# EasyEDA schematic SCH_AGV_genzero_main_board_2024-06-24.json
TITLE: Sheet_1; REV: 1.0; Date: 2024-02-19; Sheet: 1/1; Drawn By: Araf Israk; Company: Your Company
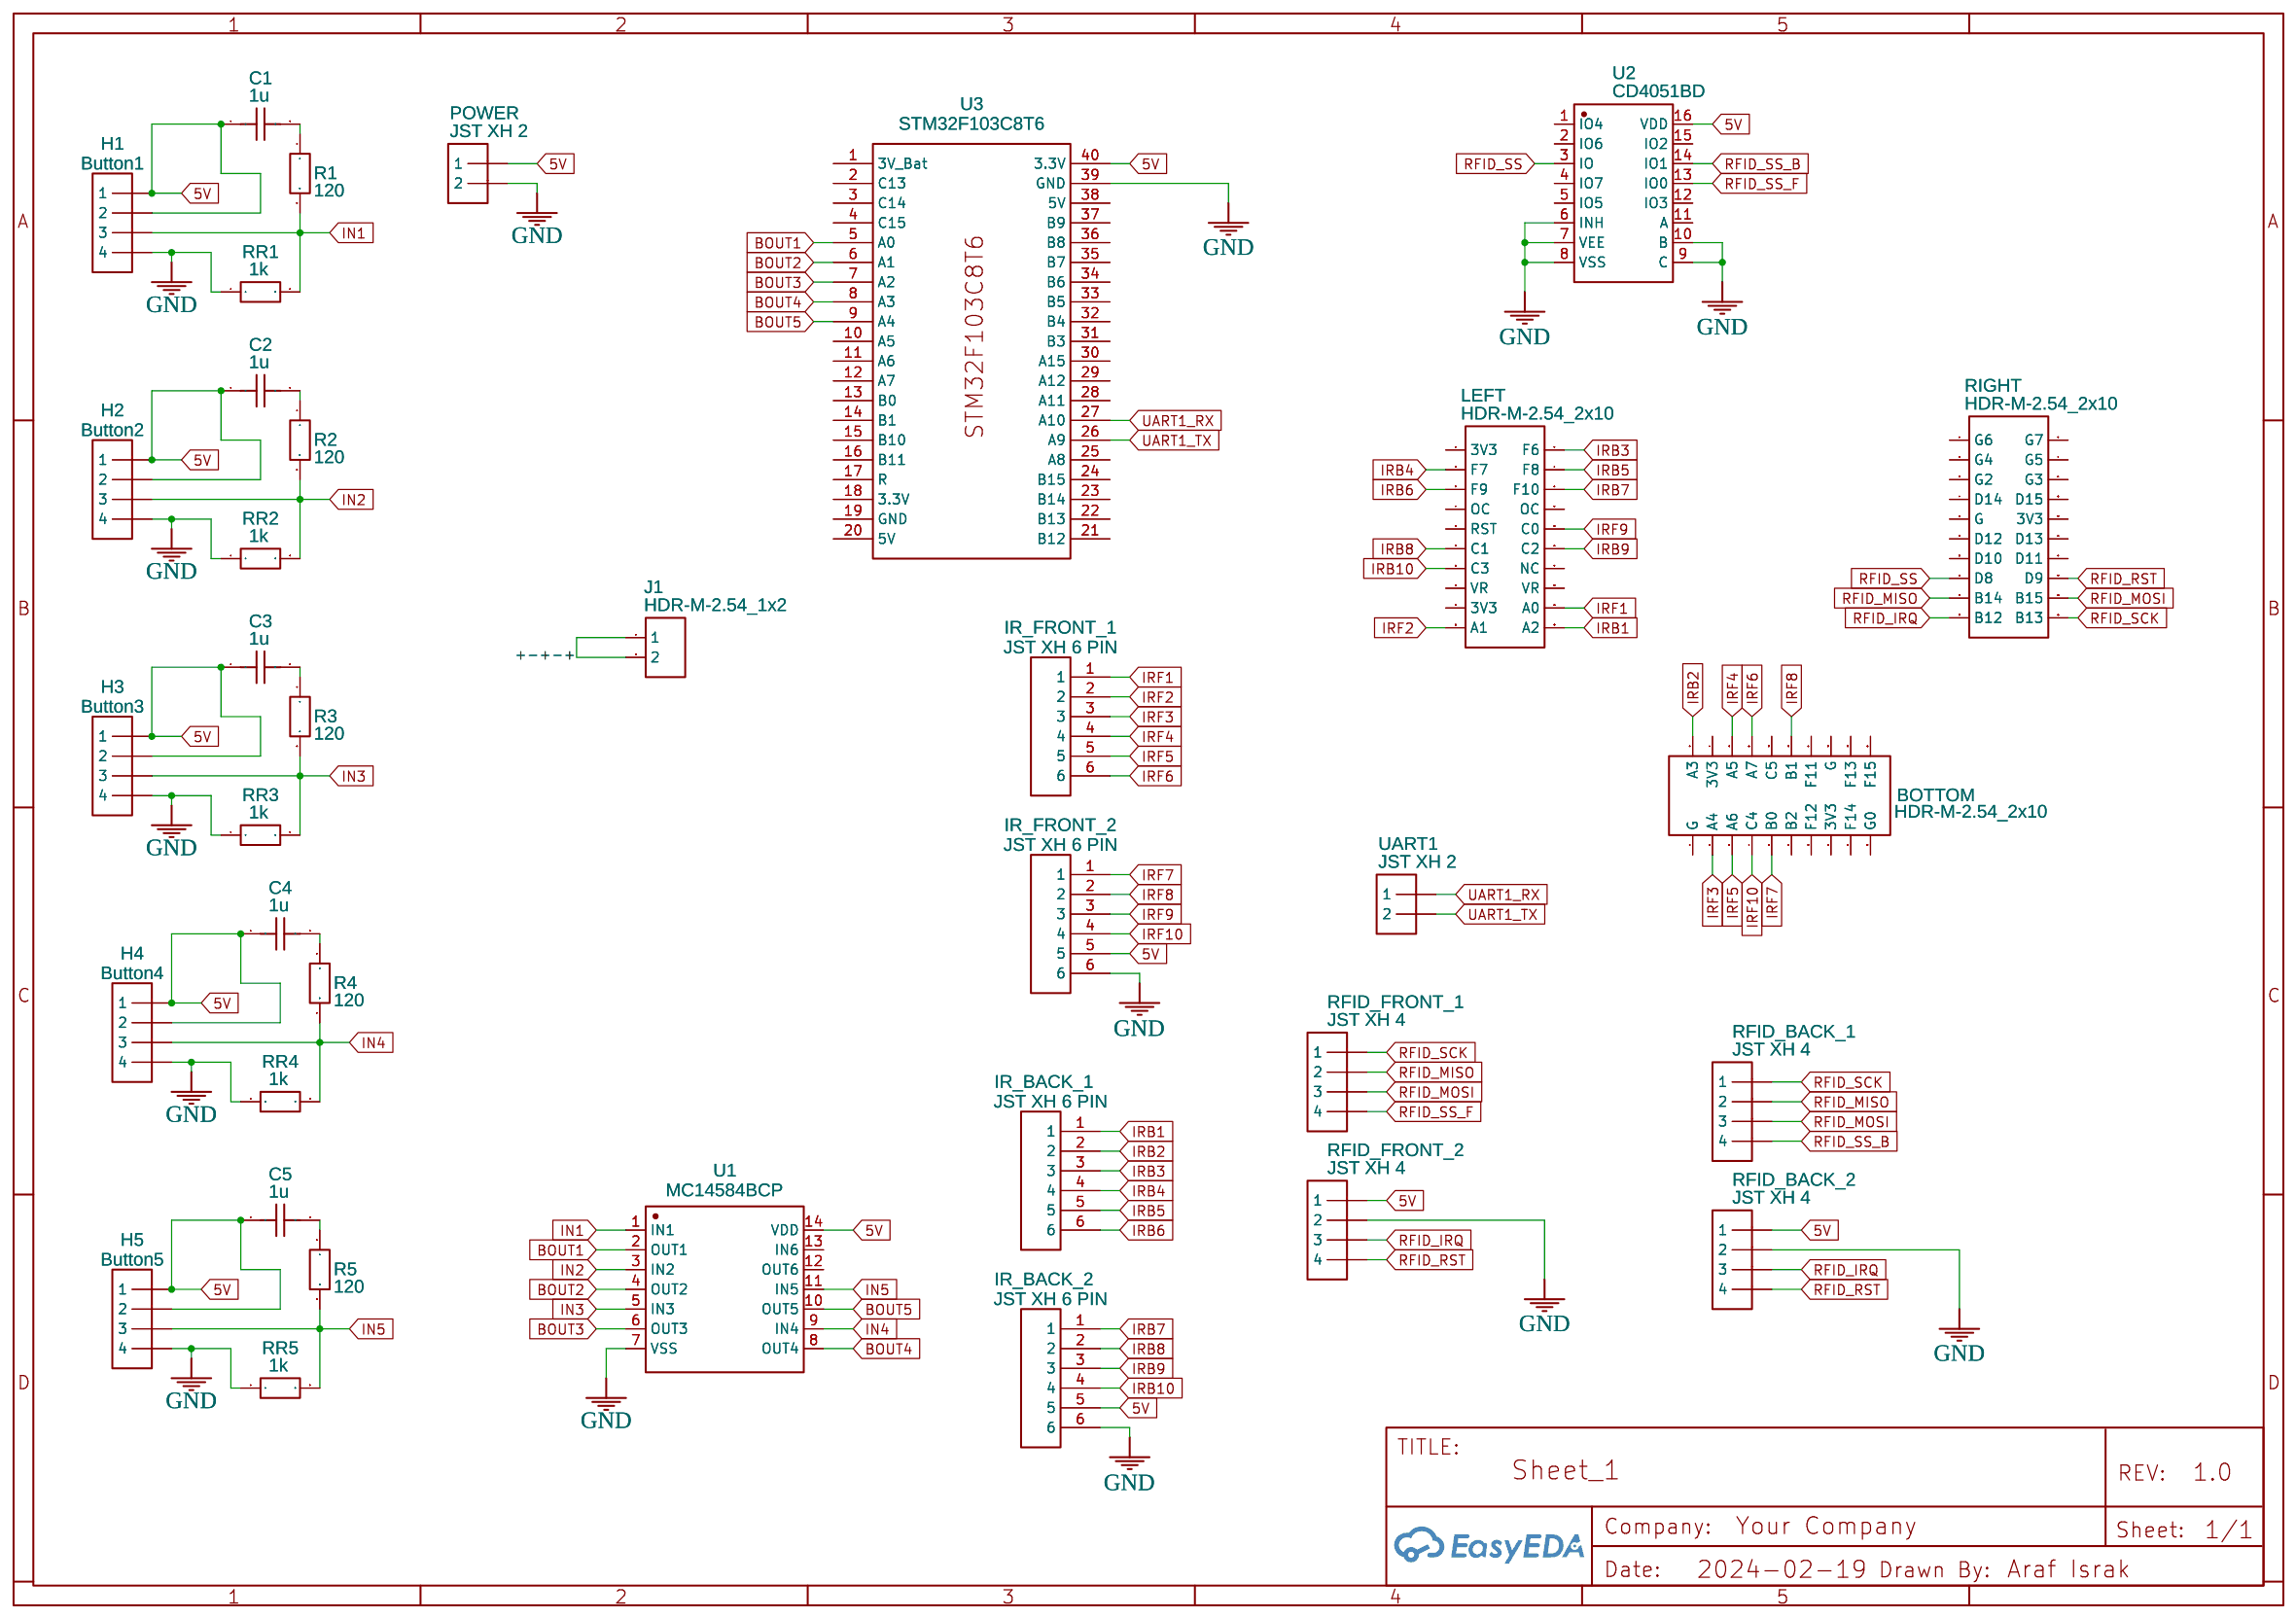
[diagram p0: schematic sheet]

## Parts
BOTTOM  HDR-M-2.54_2x10  [HDR-M-2.54_2X10]
C1  1u  [RAD-0.1]
C2  1u  [RAD-0.1]
C3  1u  [RAD-0.1]
C4  1u  [RAD-0.1]
C5  1u  [RAD-0.1]
H1  Button1  [JST-XH-TH-4-2.5]
H2  Button2  [JST-XH-TH-4-2.5]
H3  Button3  [JST-XH-TH-4-2.5]
H4  Button4  [JST-XH-TH-4-2.5]
H5  Button5  [JST-XH-TH-4-2.5]
IR_BACK_1  JST XH 6 PIN  [JST B6B-XH CONNECTOR]
IR_BACK_2  JST XH 6 PIN  [JST B6B-XH CONNECTOR]
IR_FRONT_1  JST XH 6 PIN  [JST B6B-XH CONNECTOR]
IR_FRONT_2  JST XH 6 PIN  [JST B6B-XH CONNECTOR]
J1  HDR-M-2.54_1x2  [HDR-M-2.54_1X2]
LEFT  HDR-M-2.54_2x10  [HDR-M-2.54_2X10]
POWER  JST XH 2  [JST-XH-TH-4-2.5]
R1  120  [R_AXIAL-0.4]
R2  120  [R_AXIAL-0.4]
R3  120  [R_AXIAL-0.4]
R4  120  [R_AXIAL-0.4]
R5  120  [R_AXIAL-0.4]
RFID_BACK_1  JST XH 4  [JST-XH-TH-4-2.5]
RFID_BACK_2  JST XH 4  [JST-XH-TH-4-2.5]
RFID_FRONT_1  JST XH 4  [JST-XH-TH-4-2.5]
RFID_FRONT_2  JST XH 4  [JST-XH-TH-4-2.5]
RIGHT  HDR-M-2.54_2x10  [HDR-M-2.54_2X10]
RR1  1k  [R_AXIAL-0.4]
RR2  1k  [R_AXIAL-0.4]
RR3  1k  [R_AXIAL-0.4]
RR4  1k  [R_AXIAL-0.4]
RR5  1k  [R_AXIAL-0.4]
U1  MC14584BCP  [DIP-14_L19.0-W7.0-P2.54-LS7.6-BL]
U2  CD4051BD  [DIP-16_L19.7-W6.6-P2.54-LS7.6-BL]
U3  STM32F103C8T6  [STM32F103C8T6]
UART1  JST XH 2  [JST-XH-TH-4-2.5]

## Library data of the parts
BOTTOM LEFT RIGHT = HDR-M-2.54_2x10: Supplier Part: C124359; Supplier: LCSC; Contributor: LCEDA_Lib
C1-C5 = C_RAD-0.1_US: Contributor: LCEDA_Lib
H1-H5 RFID_BACK_1 RFID_BACK_2 RFID_FRONT_1 RFID_FRONT_2 = JST XH 4: Contributor: Wahid Kasim
IR_BACK_1 IR_BACK_2 IR_FRONT_1 IR_FRONT_2 = JST XH 6 PIN: Contributor: ayphillip
J1 = HDR-M-2.54_1x2: Supplier Part: C124375; Supplier: LCSC; Contributor: LCEDA_Lib
POWER UART1 = JST XH 2: Contributor: ryanm127
R1-R5 RR1-RR5 = R_AXIAL-0.4_EU: Contributor: LCEDA_Lib
U1 = MC14584BCP: Supplier: LCSC; Manufacturer: ON; Supplier Part: C5285
U2 = CD4051BD: Supplier Part: C3033381; Manufacturer: TI(德州仪器); Manufacturer Part: CD4051BF3A; link: https://atta.szlcsc.comnull; Contributor: PapaSmurf7; Package Display: No
U3 = STM32F103C8T6: Contributor: junlakan67

## Nets
5V: C1.1 C2.1 C3.1 C4.1 C5.1 H1.1 H1.2 H2.1 H2.2 H3.1 H3.2 H4.1 H4.2 H5.1 H5.2 IR_BACK_2.5 IR_FRONT_2.5 POWER.1 RFID_BACK_2.1 RFID_FRONT_2.1 U1.14(VDD) U2.16(VDD) U3.40(3.3V)
GND: H1.4 H2.4 H3.4 H4.4 H5.4 IR_BACK_2.6 IR_FRONT_2.6 POWER.2 RFID_BACK_2.2 RFID_FRONT_2.2 RR1.1 RR2.1 RR3.1 RR4.1 RR5.1 U1.7(VSS) U2.6(INH) U2.7(VEE) U2.8(VSS) U2.9(C) U2.10(B) U3.39(GND)
+-+-+: J1.1 J1.2
BOUT1: U1.2(OUT1) U3.5(A0)
BOUT2: U1.4(OUT2) U3.6(A1)
BOUT3: U1.6(OUT3) U3.7(A2)
BOUT4: U1.8(OUT4) U3.8(A3)
BOUT5: U1.10(OUT5) U3.9(A4)
IN1: H1.3 R1.2 RR1.2 U1.1(IN1)
IN2: H2.3 R2.2 RR2.2 U1.3(IN2)
IN3: H3.3 R3.2 RR3.2 U1.5(IN3)
IN4: H4.3 R4.2 RR4.2 U1.9(IN4)
IN5: H5.3 R5.2 RR5.2 U1.11(IN5)
IRB1: IR_BACK_1.1 LEFT.20(A2)
IRB2: BOTTOM.2(A3) IR_BACK_1.2
IRB3: IR_BACK_1.3 LEFT.2(F6)
IRB4: IR_BACK_1.4 LEFT.3(F7)
IRB5: IR_BACK_1.5 LEFT.4(F8)
IRB6: IR_BACK_1.6 LEFT.5(F9)
IRB7: IR_BACK_2.1 LEFT.6(F10)
IRB8: IR_BACK_2.2 LEFT.11(C1)
IRB9: IR_BACK_2.3 LEFT.12(C2)
IRB10: IR_BACK_2.4 LEFT.13(C3)
IRF1: IR_FRONT_1.1 LEFT.18(A0)
IRF2: IR_FRONT_1.2 LEFT.19(A1)
IRF3: BOTTOM.3(A4) IR_FRONT_1.3
IRF4: BOTTOM.6(A5) IR_FRONT_1.4
IRF5: BOTTOM.5(A6) IR_FRONT_1.5
IRF6: BOTTOM.8(A7) IR_FRONT_1.6
IRF7: BOTTOM.9(B0) IR_FRONT_2.1
IRF8: BOTTOM.12(B1) IR_FRONT_2.2
IRF9: IR_FRONT_2.3 LEFT.10(C0)
IRF10: BOTTOM.7(C4) IR_FRONT_2.4
RFID_IRQ: RFID_BACK_2.3 RFID_FRONT_2.3 RIGHT.19(B12)
RFID_MISO: RFID_BACK_1.2 RFID_FRONT_1.2 RIGHT.17(B14)
RFID_MOSI: RFID_BACK_1.3 RFID_FRONT_1.3 RIGHT.18(B15)
RFID_RST: RFID_BACK_2.4 RFID_FRONT_2.4 RIGHT.16(D9)
RFID_SCK: RFID_BACK_1.1 RFID_FRONT_1.1 RIGHT.20(B13)
RFID_SS: RIGHT.15(D8) U2.3(IO)
RFID_SS_B: RFID_BACK_1.4 U2.14(IO1)
RFID_SS_F: RFID_FRONT_1.4 U2.13(IO0)
UART1_RX: U3.27(A10) UART1.1
UART1_TX: U3.26(A9) UART1.2
Net-(C1-2): C1.2 R1.1
Net-(C2-2): C2.2 R2.1
Net-(C3-2): C3.2 R3.1
Net-(C4-2): C4.2 R4.1
Net-(C5-2): C5.2 R5.1

Not connected (* = marked no-connect by the designer): BOTTOM 1(G) 4(3V3) 10(C5) 11(B2) 13(F12) 14(F11) 15(3V3) 16(G) 17(F14) 18(F13) 19(G0) 20(F15); LEFT 1(3V3) 7(OC) 8(OC) 9(RST) 14(NC) 15(VR) 16(VR) 17(3V3); RIGHT 1(G6) 2(G7) 3(G4) 4(G5) 5(G2) 6(G3) 7(D14) 8(D15) 9(G) 10(3V3) 11(D12) 12(D13) 13(D10) 14(D11); U1 12(OUT6) 13(IN6); U2 1(IO4) 2(IO6) 4(IO7) 5(IO5) 11(A) 12(IO3) 15(IO2); U3 1(3V_Bat) 2(C13) 3(C14) 4(C15) 10(A5) 11(A6) 12(A7) 13(B0) 14(B1) 15(B10) 16(B11) 17(R) 18(3.3V) 19(GND) 20(5V) 21(B12) 22(B13) 23(B14) 24(B15) 25(A8) 28(A11) 29(A12) 30(A15) 31(B3) 32(B4) 33(B5) 34(B6) 35(B7) 36(B8) 37(B9) 38(5V)
